# EAGLE design max32625pico (EAGLE 7.5.0)
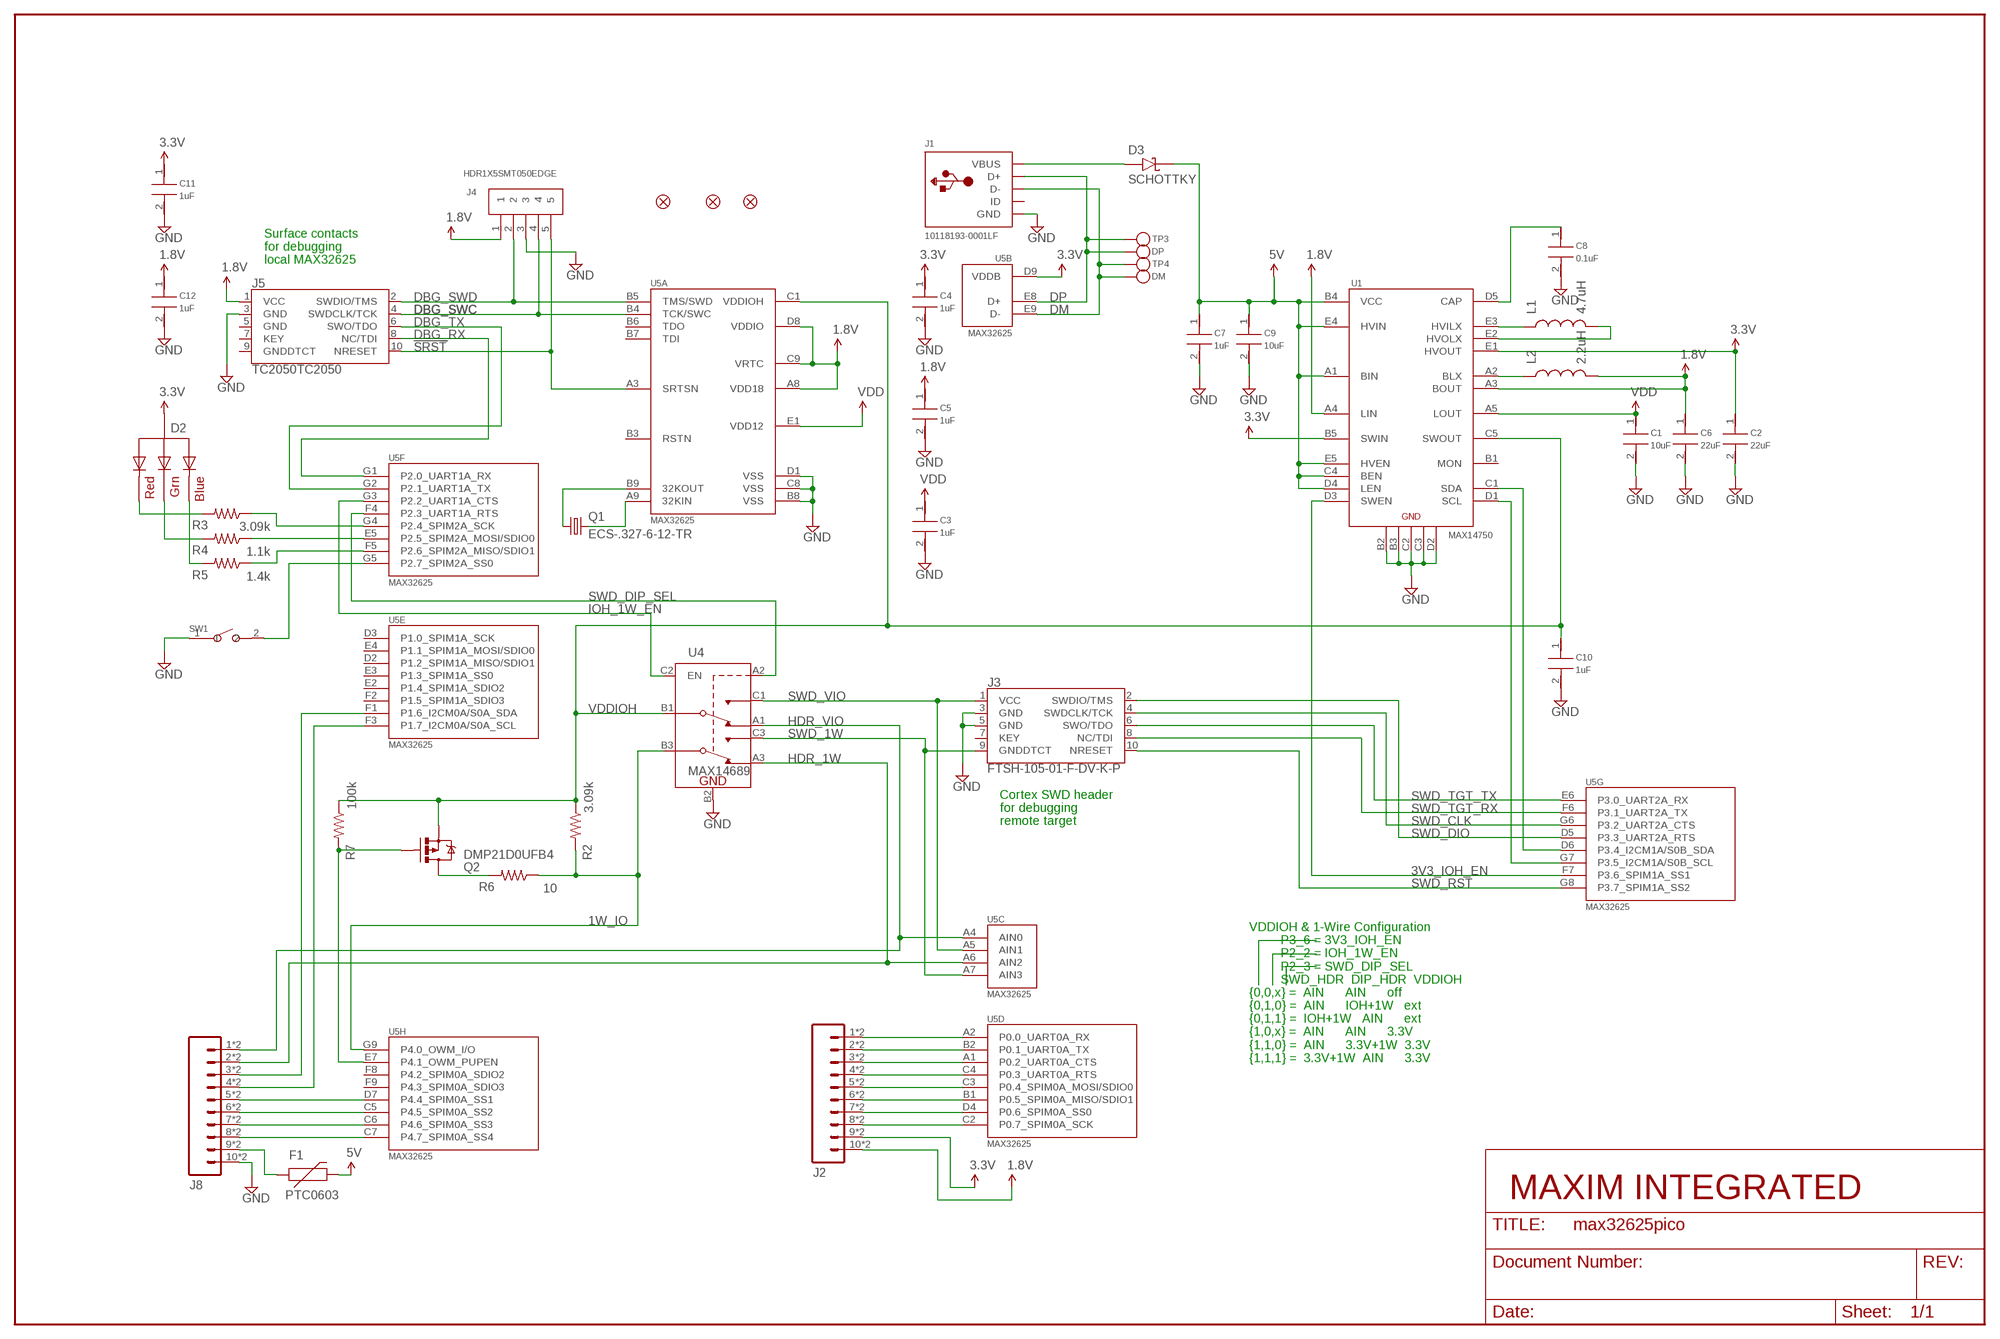
[diagram p0: schematic, sheet 1]

## Parts
C1  10uF  C  [0402]
C2  22uF  C  [0402]
C3  1uF  C  [0402]
C4  1uF  C  [0402]
C5  1uF  C  [0402]
C6  22uF  C  [0402]
C7  1uF  C  [0402]
C8  0.1uF  C  [0402]
C9  10uF  C  [0402]
C10  1uF  C  [0402]
C11  1uF  C  [0402]
C12  1uF  C  [0402]
D2  RGBLED_CALUMIX-SML-LX0404  [LUMIX-SML-LX0404]
D3  SCHOTTKY  [DCSP1006010-N1]
DM  TESTPOINTROUND1.5MM  [TESTPOINT_ROUND_1.5MM]
DP  TESTPOINTROUND1.5MM  [TESTPOINT_ROUND_1.5MM]
F1  PTC0603  [0603]
FD1  FIDUCIALUFIDUCIAL  [MICRO-FIDUCIAL]
FD2  FIDUCIALUFIDUCIAL  [MICRO-FIDUCIAL]
FD5  FIDUCIALUFIDUCIAL  [MICRO-FIDUCIAL]
J1  10118193-0001LF  MICRO-USB-SMD-B-(10118193-0001LF)  [MICRO-USB5+6P-SMD-0.65-B]
J2  M10SMT_L  [1X10_SMT_L]
J3  FTSH-105-01-F-DV-K-P  CORTEX_DEBUGSMD  [SAMTECH_FTSH-105-01]
J4  HDR1X5SMT050EDGE  [HDR_SMT_1X5_050_EDGE]
J5  TC2050TC2050  [TC2050]
J8  M10SMT_R  [1X10_SMT_R]
L1  4.7uH  INDUCTOR2016  [IND2016]
L2  2.2uH  INDUCTOR2016  [IND2016]
Q1  ECS-.327-6-12-TR  FC-12M  [FC-12M]
Q2  DMP21D0UFB4  PMZ600UNE  [SOT-883]
R2  3.09k  R-US_0402  [0402]
R3  3.09k  R-US_0402  [0402]
R4  1.1k  R-US_0402  [0402]
R5  1.4k  R-US_0402  [0402]
R6  10  R-US_0402  [0402]
R7  100k  R-US_0402  [0402]
SW1  SMD-BUTTON(2P-3.0X2.5X1.2+0.4MM)-B3U-1000P-2P-SMD  [SW2-2.6-3.0X2.5X1.2+0.4MM]
TP3  TESTPOINTRECT25X50MIL  [TESTPOINT_RECT_25X50MIL]
TP4  TESTPOINTRECT25X50MIL  [TESTPOINT_RECT_25X50MIL]
U1  MAX14750  [W252M2-1]
U4  MAX14689  [W91J1-1]
U5  MAX32625  [W633B3-1]
U$1  MAXIM_LOGO  [MXM_LOGO_6MM]

## Nets
1.8V: C5.1 C6.1 C12.1 J2.10 J2.S10 J4.1 J5.1(VCC) L2.2 U1.A3(BOUT) U1.A4(LIN) U5.A8(A:VDD18) U5.C9(A:VRTC) U5.D8(A:VDDIO)
1W_IO: R2.2 R6.1 U4.B3(COM2) U5.G9(H:P4.0_OWM_I/O)
3.3V: C2.1 C4.1 C11.1 D2.1(VCC) J2.9 J2.S9 U1.B5(SWIN) U1.E1(HVOUT) U5.D9(B:VDDB)
3V3_IOH_EN: U1.D3(SWEN) U5.F7(G:P3.6_SPIM1A_SS1)
5V: C7.1 C9.1 D3.1(C) F1.2 U1.A1(BIN) U1.B4(VCC) U1.C4(BEN) U1.D4(LEN) U1.E4(HVIN) U1.E5(HVEN)
!SRST: J4.5 J5.10(NRESET) U5.A3(A:SRTSN)
DBG_RX: J5.8(NC/TDI) U5.G1(F:P2.0_UART1A_RX)
DBG_SWC: J4.4 J5.4(SWDCLK/TCK) U5.B4(A:TCK/SWC)
DBG_SWD: J4.2 J5.2(SWDIO/TMS) U5.B5(A:TMS/SWD)
DBG_TX: J5.6(SWO/TDO) U5.G2(F:P2.1_UART1A_TX)
DM: DM.P$1 J1.2(D-) TP4.P$1 U5.E9(B:D-)
DP: DP.P$1 J1.3(D+) TP3.P$1 U5.E8(B:D+)
GND: C1.2 C2.2 C3.2 C4.2 C5.2 C6.2 C7.2 C8.2 C9.2 C10.2 C11.2 C12.2 J1.5(GND) J1.S1(GND) J1.S2(GND) J1.S3(GND) J1.S4(GND) J1.S5(GND) J1.S6(GND) J3.3(GND) J3.5(GND) J4.3 J5.3(GND) J8.10 J8.S10 SW1.1 U1.B2(GND) U1.B3(GND) U1.C2(GND) U1.C3(GND) U1.D2(GND) U4.B2(GND) U5.B8(A:VSS) U5.C8(A:VSS) U5.D1(A:VSS)
HDR_1W: J8.2 J8.S2 U4.A3(NC2) U5.A6(C:AIN2)
HDR_VIO: J8.1 J8.S1 U4.A1(NC1) U5.A4(C:AIN0)
IOH_1W_EN: U4.C2(EN) U5.G3(F:P2.2_UART1A_CTS)
N$1: J2.1 J2.S1 U5.A2(D:P0.0_UART0A_RX)
N$2: J2.2 J2.S2 U5.B2(D:P0.1_UART0A_TX)
N$4: C8.1 U1.D5(CAP)
N$5: J2.3 J2.S3 U5.A1(D:P0.2_UART0A_CTS)
N$6: J2.4 J2.S4 U5.C4(D:P0.3_UART0A_RTS)
N$7: R4.1 U5.E5(F:P2.5_SPIM2A_MOSI/SDIO0)
N$8: R3.1 U5.G4(F:P2.4_SPIM2A_SCK)
N$9: R5.1 U5.F5(F:P2.6_SPIM2A_MISO/SDIO1)
N$10: D2.2(RED) R3.2
N$11: D2.4(GREEN) R4.2
N$12: D2.3(BLUE) R5.2
N$13: D3.2(A) J1.1(VBUS)
N$14: Q1.2 U5.A9(A:32KIN)
N$15: Q1.1 U5.B9(A:32KOUT)
N$16: J2.5 J2.S5 U5.C3(D:P0.4_SPIM0A_MOSI/SDIO0)
N$17: J2.6 J2.S6 U5.B1(D:P0.5_SPIM0A_MISO/SDIO1)
N$18: J2.7 J2.S7 U5.D4(D:P0.6_SPIM0A_SS0)
N$19: J2.8 J2.S8 U5.C2(D:P0.7_SPIM0A_SCK)
N$21: F1.1 J8.9 J8.S9
N$22: Q2.3(D) R6.2
N$23: J8.8 J8.S8 U5.C7(H:P4.7_SPIM0A_SS4)
N$24: J8.7 J8.S7 U5.C6(H:P4.6_SPIM0A_SS3)
N$25: J8.6 J8.S6 U5.C5(H:P4.5_SPIM0A_SS2)
N$26: J8.5 J8.S5 U5.D7(H:P4.4_SPIM0A_SS1)
N$27: J8.4 J8.S4 U5.F3(E:P1.7_I2CM0A/S0A_SCL)
N$28: J8.3 J8.S3 U5.F1(E:P1.6_I2CM0A/S0A_SDA)
N$29: SW1.2 U5.G5(F:P2.7_SPIM2A_SS0)
N$30: L1.1 U1.E3(HVILX)
N$31: L2.1 U1.A2(BLX)
N$32: U1.D1(SCL) U5.G7(G:P3.5_I2CM1A/S0B_SCL)
N$33: L1.2 U1.E2(HVOLX)
N$34: U1.C1(SDA) U5.D6(G:P3.4_I2CM1A/S0B_SDA)
N$35: Q2.1(G) R7.2 U5.E7(H:P4.1_OWM_PUPEN)
SWD_1W: J3.9(GNDDTCT) U4.C3(NO2) U5.A7(C:AIN3)
SWD_CLK: J3.4(SWDCLK/TCK) U5.G6(G:P3.2_UART2A_CTS)
SWD_DIO: J3.2(SWDIO/TMS) U5.D5(G:P3.3_UART2A_RTS)
SWD_DIP_SEL: U4.A2(CB) U5.F4(F:P2.3_UART1A_RTS)
SWD_RST: J3.10(NRESET) U5.G8(G:P3.7_SPIM1A_SS2)
SWD_TGT_RX: J3.8(NC/TDI) U5.F6(G:P3.1_UART2A_TX)
SWD_TGT_TX: J3.6(SWO/TDO) U5.E6(G:P3.0_UART2A_RX)
SWD_VIO: J3.1(VCC) U4.C1(NO1) U5.A5(C:AIN1)
VDD: C1.1 C3.1 U1.A5(LOUT) U5.E1(A:VDD12)
VDDIOH: C10.1 Q2.2(S) R2.1 R7.1 U1.C5(SWOUT) U4.B1(COM1) U5.C1(A:VDDIOH)
Unconnected: J1.4(ID) J3.7(KEY) J5.5(GND) J5.7(KEY) J5.9(GNDDTCT) U1.B1(MON) U5.B3(A:RSTN) U5.B6(A:TDO) U5.B7(A:TDI) U5.D2(E:P1.2_SPIM1A_MISO/SDIO1) U5.D3(E:P1.0_SPIM1A_SCK) U5.E2(E:P1.4_SPIM1A_SDIO2) U5.E3(E:P1.3_SPIM1A_SS0) U5.E4(E:P1.1_SPIM1A_MOSI/SDIO0) U5.F2(E:P1.5_SPIM1A_SDIO3) U5.F8(H:P4.2_SPIM0A_SDIO2) U5.F9(H:P4.3_SPIM0A_SDIO3)

## Notes on the sheet
- Surface contacts 
  for debugging 
  local MAX32625
- Cortex SWD header
  for debugging 
  remote target
- VDDIOH & 1-Wire Configuration
           P3_6 = 3V3_IOH_EN
           P2_2 = IOH_1W_EN
           P2_3 = SWD_DIP_SEL
           SWD_HDR  DIP_HDR  VDDIOH
  {0,0,x} =  AIN      AIN      off
  {0,1,0} =  AIN      IOH+1W   ext
  {0,1,1} =  IOH+1W   AIN      ext
  {1,0,x} =  AIN      AIN      3.3V
  {1,1,0} =  AIN      3.3V+1W  3.3V
  {1,1,1} =  3.3V+1W  AIN      3.3V

## Library data of the parts
C1-C12 = maxlib:C: C Capacitor
D2 = maxlib:RGBLED_CA: RGB LED, common-anode Lumix SML-LX0404 1mm x 1mm 5MM Staggered pins 5mm Piranha package http://www.ladyada.net/library/pcb/eaglelibrary.html
D3 = maxlib:SCHOTTKY: Schottky Diode
DM DP TP3 TP4 = maxlib:TESTPOINT: Test Point Various test points for characterisation and PCB testing TESTPOINT_SMT - Compact Surface Mount Test Point [Digikey: 5016KTR-ND]
F1 = maxlib:PTC: Resettable Fuse PTC Resettable Fuse. Spark Fun Electronics SKU : COM-08357
FD1 FD2 FD5 = SparkFun-Aesthetics:FIDUCIAL: Fiducial Alignment Points Various fiducial points for machine vision alignment.
J1 = maxlib:MICRO-USB-SMD-B-(10118193-0001LF): 320010003; MPN: 10118193-0001LF
J2 J8 = maxlib:M10: Header 10 Standard 10-pin 0.1" header. Use with straight break away headers (SKU : PRT-00116), right angle break away headers (PRT-00553), swiss pins (PRT-00743), machine pins (PRT-00117), and female headers (PRT-00115).
J3 = maxlib:CORTEX_DEBUG: Cortex Debug Connector Datasheet <http://infocenter.arm.com/help/topic/com.arm.doc.faqs/attached/13634/cortex_debug_connectors.pdf>
J4 = maxlib:HDR1X5SMT050EDGE: 1x5 SMT Header 50mil Pitch 1x5 50mil pitch SMT header for edge mount
J5 = maxlib:TC2050: TAG-CONNECT ISP Connector Manufacturer: Tag-Connect <www.tag-connect.com> Cable for easy In-Circuit PCB Programming. Designed for JTAG 10 pin, suitable for many others. Pin Connection for TC2050 NL. PAD Description 1 VCC 2 SWD 3 GND 4 SWC 5 GND 6 TX 7 NC 8 RX 9 DETECT 10 RESET ©2009 ROFA.cz Modified 7/2011 by Tim McCarthy-Smith VIDA Products INC
L1 L2 = maxlib:INDUCTOR: Inductor Inductors
Q1 = crystal:FC-12M: kHz RANGE CRYSTAL UNIT LOW PROFILE SMD Source: Epson Toyocom FC-12M.pdf
Q2 = maxlib:PMZ600UNE
R2-R7 = maxlib:R-US_: RESISTOR, American symbol
SW1 = maxlib:SMD-BUTTON(2P-3.0X2.5X1.2+0.4MM): 311020047
U1 = maxlib:MAX14750
U4 = maxlib:MAX14689
U5 = maxlib:MAX32625: MAX32625 Ultra-Low Power, High-Performance Cortex-M4F Microcontroller for Wearables
U$1 = maxlib:MAXIM_LOGO: Maxim Logo

## Board
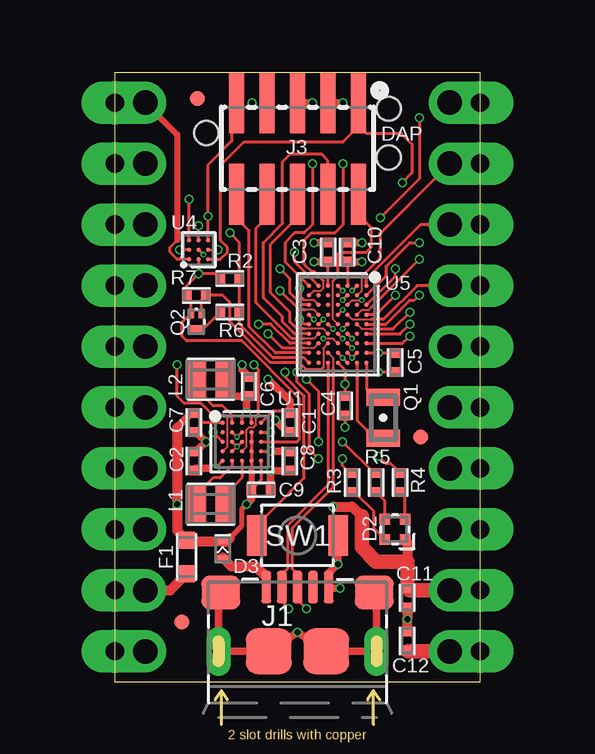
[diagram p1: board, top side]
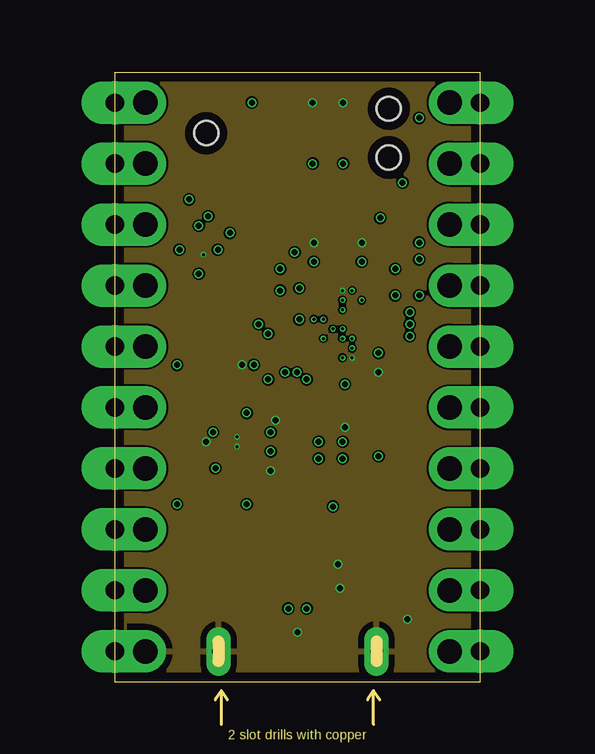
[diagram p2: board, inner layer Route2]
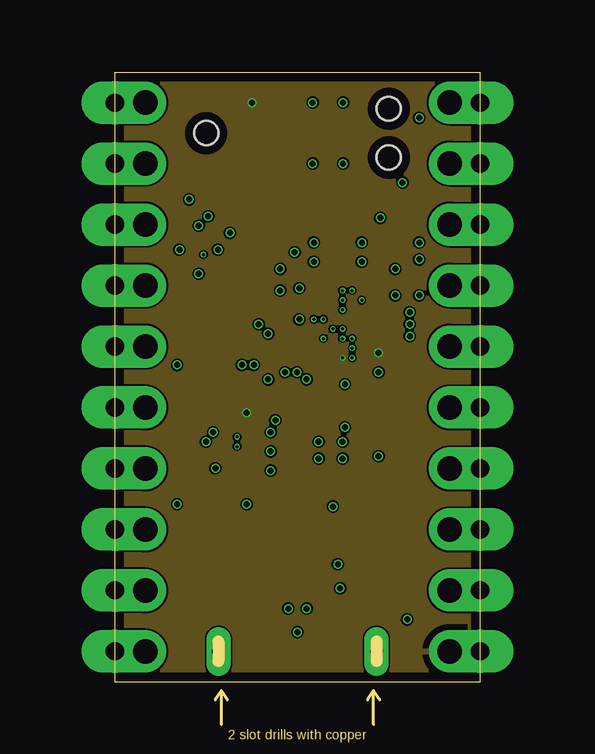
[diagram p3: board, inner layer Route15]
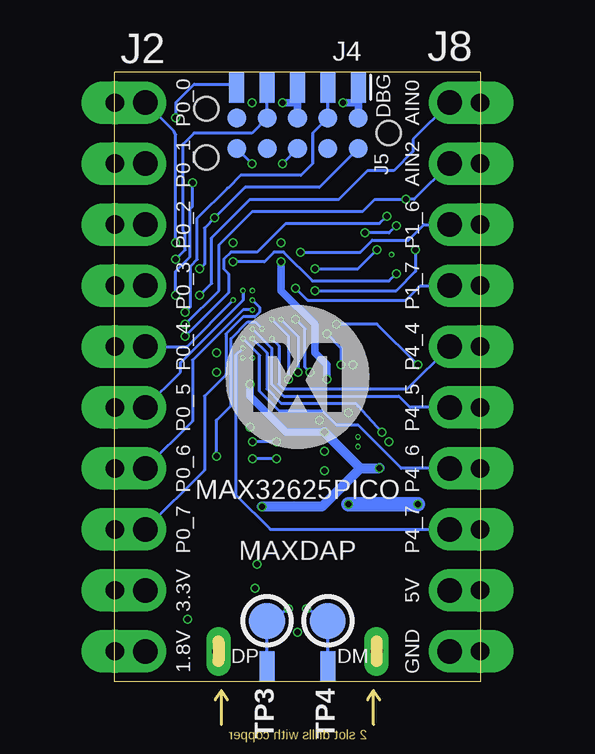
[diagram p4: board, bottom side, seen from below]

Size 15.24 x 25.4 mm. Coordinates in mm from the lower left corner, seen from the top.
Outline: 0,0 15.24,0 15.24,25.4 0,25.4 0,0
Copper layers (1+2*15+16): Top 0.035mm / dielectric 0.18mm / Route2 0.035mm / dielectric 0.15mm / Route15 0.035mm / dielectric 0.18mm / Bottom 0.035mm
Design rules "default *": minimum track width 0.075mm, minimum drill 4mil, track to track 0.07mm, track to pad 0.07mm, pad to pad 0.1mm, via to via 0.125mm, smd to smd 0.07mm, copper to edge 15mil, drill to drill 8mil, minimum pad ring 10mil, minimum via ring 2mil, stop-mask expansion 0mil, vias tented up to drill 15mil, thermal gap 10mil

### Footprints (pad centres in the part's own frame; a part is rotated, then mirrored left to right if it is on the bottom)
0402 = smd 0.5 x 0.4: 1 0,0.4; 2 0,-0.4
LUMIX-SML-LX0404 = smd 0.45 x 0.45: 1 -0.425,0.425; 2 0.425,0.425; 3 0.425,-0.425; 4 -0.425,-0.425
DCSP1006010-N1 = smd 0.47 x 0.21: 1 0,0.33; 2 0,-0.33
TESTPOINT_ROUND_1.5MM = smd 1.5 x 1.5: P$1 0,0
0603 = smd 0.7 x 0.7: 1 0,0.7; 2 0,-0.7
MICRO-FIDUCIAL = smd 0.635 x 0.635: 1 0,0
MICRO-USB5+6P-SMD-0.65-B = smd 0.4 x 1.35: 1 -1.3,2.675; 2 -0.65,2.675; 3 0,2.675; 4 0.65,2.675; 5 1.3,2.675 | smd 1.6 x 1.4: S1 -3.2,2.45; S6 3.2,2.45 | drill 0.508 pad 1.016 long: S2 -3.3,0; S5 3.3,0 | smd 1.9 x 1.9: S3 -1.2,0; S4 1.2,0
1X10_SMT_L = drill 1.016 pad 1.778 offset: 1 0,0; 2 2.54,0; 3 5.08,0; 4 7.62,0; 5 10.16,0; 6 12.7,0; 7 15.24,0; 8 17.78,0; 9 20.32,0; 10 22.86,0 | drill 0.762 pad 1.778: S1 0,-1.27; S2 2.54,-1.27; S3 5.08,-1.27; S4 7.62,-1.27; S5 10.16,-1.27; S6 12.7,-1.27; S7 15.24,-1.27; S8 17.78,-1.27; S9 20.32,-1.27; S10 22.86,-1.27
SAMTECH_FTSH-105-01 = smd 0.635 x 2.54: 1 -2.54,-1.905; 2 -2.54,1.905; 3 -1.27,-1.905; 4 -1.27,1.905; 5 0,-1.905; 6 0,1.905; 7 1.27,-1.905; 8 1.27,1.905; 9 2.54,-1.905; 10 2.54,1.905
HDR_SMT_1X5_050_EDGE = smd 0.635 x 1.27: 1 -2.54,0; 2 -1.27,0; 3 0,0; 4 1.27,0; 5 2.54,0
TC2050 = smd 0.787 x 0.787: 1 1.27,-0.635; 2 2.54,-0.635; 3 3.81,-0.635; 4 5.08,-0.635; 5 6.35,-0.635; 6 6.35,0.635; 7 5.08,0.635; 8 3.81,0.635; 9 2.54,0.635; 10 1.27,0.635 | hole 1: 0,0; 7.62,-1.016; 7.62,1.016
1X10_SMT_R = drill 1.016 pad 1.778 offset: 1 0,0; 2 2.54,0; 3 5.08,0; 4 7.62,0; 5 10.16,0; 6 12.7,0; 7 15.24,0; 8 17.78,0; 9 20.32,0; 10 22.86,0 | drill 0.762 pad 1.778: S1 0,1.27; S2 2.54,1.27; S3 5.08,1.27; S4 7.62,1.27; S5 10.16,1.27; S6 12.7,1.27; S7 15.24,1.27; S8 17.78,1.27; S9 20.32,1.27; S10 22.86,1.27
IND2016 = smd 1.6 x 0.8: 1 0,0.6; 2 0,-0.6
FC-12M = smd 0.7 x 1.4: 1 -0.85,0; 2 0.85,0
SOT-883 = smd 0.25 x 0.4: 1 -0.225,-0.35; 2 0.225,-0.35 | smd 0.7 x 0.4: 3 0,0.35
SW2-2.6-3.0X2.5X1.2+0.4MM = smd 0.8 x 1.7: 1 -1.7,0; 2 1.7,0
TESTPOINT_RECT_25X50MIL = smd 1.27 x 0.635: P$1 0,0
W252M2-1 = smd 0.18 x 0.18: A1 -0.8,0.8; A2 -0.4,0.8; A3 0,0.8; A4 0.4,0.8; A5 0.8,0.8; B1 -0.8,0.4; B2 -0.4,0.4; B3 0,0.4; B4 0.4,0.4; B5 0.8,0.4; C1 -0.8,0; C2 -0.4,0; C3 0,0; C4 0.4,0; C5 0.8,0; D1 -0.8,-0.4; D2 -0.4,-0.4; D3 0,-0.4; D4 0.4,-0.4; D5 0.8,-0.4; E1 -0.8,-0.8; E2 -0.4,-0.8; E3 0,-0.8; E4 0.4,-0.8; E5 0.8,-0.8
W91J1-1 = smd 0.18 x 0.18: A1 -0.4,0.4; A2 0,0.4; A3 0.4,0.4; B1 -0.4,0; B2 0,0; B3 0.4,0; C1 -0.4,-0.4; C2 0,-0.4; C3 0.4,-0.4
W633B3-1 = smd 0.18 x 0.18: A1 -1.6,1.2; A2 -1.2,1.2; A3 -0.8,1.2; A4 -0.4,1.2; A5 0,1.2; A6 0.4,1.2; A7 0.8,1.2; A8 1.2,1.2; A9 1.6,1.2; B1 -1.6,0.8; B2 -1.2,0.8; B3 -0.8,0.8; B4 -0.4,0.8; B5 0,0.8; B6 0.4,0.8; B7 0.8,0.8; B8 1.2,0.8; B9 1.6,0.8; C1 -1.6,0.4; C2 -1.2,0.4; C3 -0.8,0.4; C4 -0.4,0.4; C5 0,0.4; C6 0.4,0.4; C7 0.8,0.4; C8 1.2,0.4; C9 1.6,0.4; D1 -1.6,0; D2 -1.2,0; D3 -0.8,0; D4 -0.4,0; D5 0,0; D6 0.4,0; D7 0.8,0; D8 1.2,0; D9 1.6,0; E1 -1.6,-0.4; E2 -1.2,-0.4; E3 -0.8,-0.4; E4 -0.4,-0.4; E5 0,-0.4; E6 0.4,-0.4; E7 0.8,-0.4; E8 1.2,-0.4; E9 1.6,-0.4; F1 -1.6,-0.8; F2 -1.2,-0.8; F3 -0.8,-0.8; F4 -0.4,-0.8; F5 0,-0.8; F6 0.4,-0.8; F7 0.8,-0.8; F8 1.2,-0.8; F9 1.6,-0.8; G1 -1.6,-1.2; G2 -1.2,-1.2; G3 -0.8,-1.2; G4 -0.4,-1.2; G5 0,-1.2; G6 0.4,-1.2; G7 0.8,-1.2; G8 1.2,-1.2; G9 1.6,-1.2

### Placement (x,y rotation side)
C1  7.3,10.8 0 top
C2  3.3,9.2 180 top
C3  8.9,17.9 180 top
C4  9.6,11.5 0 top
C5  11.7,13.3 0 top
C6  5.6,12.3 180 top
C7  3.3,10.8 0 top
C8  7.3,9.2 0 top
C9  6.1,8 90 top
C10  9.7,17.9 180 top
C11  12.2,3.5 0 top
C12  12.2,1.7 180 top
D2  11.68,6.35 180 top
D3  4.5,5.5 0 top
DM  6.35,2.54 0 bottom
DP  8.89,2.54 0 bottom
DRILEGEND  [DRILEGEND]  1.08,-6.65 0 top  (outside the outline)
F1  3,5.2 180 top
FD1  12.76,10.2 90 top
FD2  3.44,24.3 0 top
FD5  2.8,2.5 270 top
J1  7.62,1.27 0 top
J2  13.97,24.13 270 bottom
J3  7.62,22.23 180 top
J4  7.62,24.77 180 bottom
J5  3.81,22.86 180 bottom
J8  1.27,24.13 270 bottom
L1  4,7.4 270 top
L2  4,12.6 90 top
Q1  11.2,11 90 top
Q2  3.4,15 180 top
R2  4.8,16.8 90 top
R3  9.9,8.3 0 top
R4  11.9,8.3 0 top
R5  10.9,8.3 0 top
R6  4.8,15.4 270 top
R7  3.4,16.1 90 top
SW1  7.62,6.1 180 top
TP3  8.89,0.64 270 bottom
TP4  6.35,0.64 270 bottom
U1  5.3,10 0 top
U4  3.5,18 90 top
U5  9.3,14.9 270 top
U$1  7.62,12.7 0 bottom

### Tracks (layer width: path | path; a pad name or v marks a point on that pad's centre or on a via)
1.8V  (via drill 0.12, 0.25)
  Top 0.125: U5.A8 v11,13.7 C5.1 | U5.D8 v9.5,13.5 U5.C9 | U1.A3 5.3,11 v5.5,11.2 5.7,11 U1.A4
  Top 0.305: v5.5,11.2 5.5,11.8 C6.1 4.9,11.9 4.8,12 4.8,12.4 L2.2
  Top 0.406: 12.23,1.27 C12.1
  Top 0.61: J2.10 12.23,1.27
  Bottom 0.305: J4.1 5.08,24.13 | 5.08,24.13 J5.1 | v5.71,24.13 5.08,24.13
  pour Route15: 0,0 0,25.4 15.24,25.4 15.24,0
1W_IO  (via drill 0.25)
  Top 0.125: U4.B3 v3.5,19 | v4.8,18.7 5.2,18.3 R2.2 R6.1 5.2,14.9 6.6,13.5 7.9,13.5 U5.G9
  Bottom 0.125: v3.5,19 3.8,18.7 v4.8,18.7
3.3V  (via drill 0.25)
  Top 0.125: U1.E1 v4.2,8.9 | 3.4,8.9 C2.1 | U5.D9 9.6,13 v9.6,12.4 C4.1 | U1.B5 v6.5,10.4
  Top 0.305: v4.2,8.9 3.4,8.9 | J2.9 J2.S9
  Top 0.406: 12.29,3.81 C11.1 | v9.1,7.3 9.9,7.3 10.3,6.9 | D2.1 12.2,5.83 12.2,5
  Top 0.61: J2.9 12.29,3.81 | 10.3,6.9 10.3,5.6 10.9,5 12.2,5 C11.1
  Bottom 0.305: v9.6,12.4 C4.1 8.1,10.4 v6.5,10.4
  Bottom 0.406: 5,8.9 v4.2,8.9 | v6.5,10.4 5,8.9 | 5,8.9 6.6,7.3 v9.1,7.3
3V3_IOH_EN  (via drill 0.25)
  Top 0.075: U1.D3 5.5,9.8 5.5,10.5 5.6,10.6 5.8,10.6 5.9,10.7 5.9,11 | U5.F7 8.3,13.9 7.9,13.9
  Top 0.125: 7.9,13.9 7,13.9 v6.4,14.5 | 5.9,11 6,11.1 6,13 v5.8,13.2
  Bottom 0.125: v6.4,14.5 5.8,13.9 v5.8,13.2
5V  (via drill 0.25)
  Top 0.125: 3.4,11.1 C7.1 | 5.7,8.8 U1.E4 U1.D4 U1.C4 U1.B4 | 3.1,11.1 3.2,11.2 C7.1 | U1.A1 3.7,10.8 C7.1 | U1.E5 6.1,8.4 C9.1
  Top 0.203: 4.8,6 5.3,6.5 5.3,7.2 v5.5,7.4
  Top 0.254: 5.7,8.8 C9.1
  Top 0.305: 2.6,10.6 3.1,11.1 | C9.1 5.7,7.6 v5.5,7.4
  Top 0.406: 2.6,10.6 v2.6,7.4 2.6,6.3 F1.2 3.07,5.83 D3.1 4.63,5.83 4.8,6
  Bottom 0.61: v5.5,7.4 v2.6,7.4
!SRST  (via drill 0.25)
  Top 0.125: U5.A3 11.7,16.9 v11.7,17.2
  Top 0.127: v12.7,23.5 12.7,20.95 v11.07,19.33
  Bottom 0.125: v11.7,17.2 11.5,17.4 11.5,18.9 v11.07,19.33 9.8,20.6 6.71,20.6 J5.10
  Bottom 0.127: v12.7,23.5 12.7,24.13 11.93,24.9 10.29,24.9 J4.5
DBG_RX  (via drill 0.25)
  Top 0.125: v8.26,21.59 8.26,19.05 8.25,19.05 7.9,18.7 7.5,18.7 7.1,18.3 7.1,17.5 U5.G1
  Bottom 0.125: J5.8 v8.26,21.59
DBG_SWC  (via drill 0.25)
  Top 0.075: U5.B4 10.3,15.5 10.6,15.5 10.7,15.6
  Top 0.125: 10.7,15.6 v12.7,17.6
  Bottom 0.125: v12.7,17.6 12.3,18 12.3,18.7 12.4,18.8 12.4,22.4 11.94,22.86 9.53,22.86 J5.4 J4.4
DBG_SWD  (via drill 0.25)
  Top 0.075: U5.B5 10.3,14.7 10.7,14.7
  Top 0.125: 10.7,14.7 11.6,14.7 v12.3,15.4
  Bottom 0.125: v12.3,15.4 12.1,15.6 12.1,17.3 11.8,17.6 11.8,19.32 10.54,20.57 10.53,20.57 10,21.1 7.47,21.1 6.99,21.59 6.99,22.86 J5.2 J4.2
DBG_TX  (via drill 0.25)
  Top 0.075: U5.G2 8.3,16.3 8.6,16.3 8.7,16.4 8.7,16.7
  Top 0.125: v9.53,21.59 9.53,19.05 9.18,18.7 8.2,18.7 7.9,18.4 7.9,17.4 8.2,17.1 8.3,17.1 8.7,16.7
  Bottom 0.125: J5.6 v9.53,21.59
DM  (via drill 0.25)
  Top 0.125: U5.E9 8.9,8.2 7.2,6.5 7.2,4.7
  Top 0.127: 7.2,4.7 6.97,4.47 J1.2 7.1,3.81 7.1,3.19 v7.24,3.05
  Bottom 0.127: v7.24,3.05 DM.P$1 TP4.P$1
DP  (via drill 0.25)
  Top 0.075: U5.E8 9.1,13.5 9.1,13.1
  Top 0.125: 9.1,13.1 9.1,8.1 7.4,6.4 7.4,4.7
  Top 0.127: 7.62,3.68 J1.3 | J1.3 7.62,4.48 7.4,4.7 | v8,3.05 7.62,3.43 J1.3
  Bottom 0.127: v8,3.05 DP.P$1 TP3.P$1
GND  (via drill 0.12, 0.25)
  Top 0.125: C2.2 3.5,9.7 | C7.2 3.5,10.3 | U1.B2 v5.1,10.2 U1.B3 | U1.C2 v5.1,9.8 | U1.D2 v5.1,9.8 | v5.1,9.8 U1.C3 | C4.2 v9.6,10.6 | C5.2 v11,12.9 | U5.C8 v9.9,13.5 U5.B8 | U5.D1 v9.5,16.3 | 8.89,23.5 J3.3 | U4.B2 v3.7,17.8
  Top 0.305: 3.5,9.7 v3.8,10 3.5,10.3 | C9.2 v6.5,8.8 C8.2 | C10.2 v10.3,18.3 | C3.2 v8.3,18.3 | C6.2 5.3,13 v5.3,13.2 | C1.2 7.2,10.4 v6.7,10.9 | 8.89,23.19 8.89,23.5 | J5.3 J3.5 v8.26,24.13 | v9.53,24.13 J3.3 | J1.S6 10.92,3.8 J1.S5 J1.S4 v7.62,2.07 J1.S3 J1.S2 4.32,3.8 J1.S1 | v9.4,3.9 8.96,3.9 J1.5 8.92,4.52 v9.3,4.9 9.3,6.08 SW1.1
  Top 0.406: C12.2 v12.2,2.6 C11.2
  Bottom 0.305: J4.3 J3.5 | J3.5 J5.3 | v8.26,24.13 J3.5
  pour Route2: 0,0 0,25.4 15.24,25.4 15.24,0
HDR_1W  (via drill 0.25)
  Top 0.125: U5.A6 11.9,14.5 v12.3,14.9 | U4.A3 v3.1,20.1
  Top 0.305: J8.2 J8.S2
  Bottom 0.125: v12.3,14.9 10.9,16.3 10.9,18.2 9.5,19.6 4.9,19.6 4.4,20.1 v3.1,20.1 2.76,20.1 J8.2
HDR_VIO  (via drill 0.25)
  Top 0.125: v11.7,16.1 10.9,15.3 U5.A4 | U4.A1 2.6,17.6 2.3,17.9 2.3,18.1 2.6,18.4
  Top 0.25: J8.1 2.6,22.8 2.6,18.4
  Top 0.305: J8.1 J8.S1
  Bottom 0.125: v11.7,16.1 11.2,16.6 11.2,18.5 9.6,20.1 5.9,20.1 4.7,21.3 3.6,21.3 2.8,22.1 2.8,22.6 J8.1
IOH_1W_EN  (via drill 0.25)
  Top 0.125: U4.C2 v4.3,18 | U5.G3 7.8,15.7 7.3,16.2 7.3,16.8 v6.9,17.2
  Bottom 0.125: v6.9,17.2 5.1,17.2 v4.3,18
N$1  (via drill 0.25)
  Top 0.125: v12.7,18.3 12.3,18.3 11.3,17.3 11.3,16.9 U5.A2
  Top 0.305: J2.1 J2.S1
  Bottom 0.125: J2.1 12.77,22.93 12.7,22.8 v12.7,18.3
N$2
  Top 0.075: U5.B2 10.3,16.3 10.3,16.9
  Top 0.125: 10.3,16.9 11.05,17.65 11.05,18.67 J2.2
  Top 0.305: J2.2 J2.S2
N$4  (via drill 0.25)
  Top 0.125: U1.D5 v6.5,9.6
  Top 0.305: v6.5,9.6 C8.1
N$5
  Top 0.125: J2.3 12.75,19.05 10.5,16.8 U5.A1
  Top 0.305: J2.3 J2.S3
N$6
  Top 0.075: U5.C4 9.9,15.1 10.7,15.1
  Top 0.125: 10.7,15.1 11.2,15.1 12.61,16.51 J2.4
  Top 0.305: J2.4 J2.S4
N$7  (via drill 0.12, 0.25)
  Top 0.125: U5.E5 v9.1,14.7 | 11.8,8.7 R4.1 11.5,9.1 11.3,9.1 v11,9.4
  Bottom 0.125: v11,9.4 11,10.9 10.4,11.5 10.4,14.3 9.7,15 9.4,15 v9.1,14.7
N$8  (via drill 0.12, 0.25)
  Top 0.125: v8.5,9.3 8.1,9.7 8.1,12 7.6,12.5 v7.6,12.9 | R3.1 9.8,8.7 9.5,9 v9.5,9.3 | U5.G4 v8.3,15.1
  Bottom 0.125: v8.5,9.3 v9.5,9.3 | v8.3,15.1 7.6,14.4 v7.6,12.9
N$9  (via drill 0.12, 0.25)
  Top 0.125: U5.F5 v8.7,15.1 | v8.5,10 8.5,12.1 v8,12.6 | v9.5,10 10.8,8.7 R5.1
  Bottom 0.125: v8.7,15.1 8,14.4 v8,12.6 | v8.5,10 v9.5,10
N$10
  Top 0.127: D2.2 11.26,5.94 10.8,6.4 10.8,7.1 10,7.9 R3.2
N$11
  Top 0.127: D2.4 12.11,7.69 R4.2
N$12
  Top 0.127: D2.3 11.26,7.54 R5.2
N$13
  Top 0.305: J1.1 6.32,4.38
  Top 0.406: 6.32,4.38 5.9,4.8 4.87,4.8 D3.2
N$14
  Top 0.125: U5.A9 10.5,12.2 10.6,12.1 10.95,12.1 Q1.2
N$15
  Top 0.125: U5.B9 10.1,10.9 10.6,10.4 10.95,10.4 Q1.1
N$16  (via drill 0.12)
  Top 0.075: U5.C3 9.9,15.9 v10.3,15.9
  Top 0.305: J2.5 J2.S5
  Bottom 0.125: J2.5 12.23,13.97 v10.3,15.9
N$17  (via drill 0.12)
  Top 0.125: U5.B1 v9.9,16.3
  Top 0.305: J2.6 J2.S6
  Bottom 0.125: J2.6 12.5,12.9 12.5,13.3 9.9,15.9 v9.9,16.3
N$18  (via drill 0.12)
  Top 0.125: U5.D4 v9.5,15.5
  Top 0.305: J2.7 J2.S7
  Bottom 0.125: v9.5,15.5 9.9,15.5 12,13.4 12,10.86 J2.7
N$19  (via drill 0.12)
  Top 0.125: U5.C2 v9.5,15.9
  Top 0.305: J2.8 J2.S8
  Bottom 0.125: v9.5,15.9 9.2,15.6 9.2,15.4 9.4,15.2 9.9,15.2 10.6,14.5 10.6,12.8 11.5,11.9 11.5,8.82 J2.8
N$21
  Top 0.305: J8.9 J8.S9
  Top 0.406: J8.9 2.31,3.81 F1.1
N$22
  Top 0.125: Q2.3 3.65,14.65 R6.2
N$23  (via drill 0.12)
  Top 0.125: U5.C7 v9.9,13.9
  Top 0.305: J8.8 J8.S8
  Bottom 0.125: v9.9,13.9 10.2,13.6 10.2,7.8 | 8.6,6.35 8.1,6.35 J8.8
  Bottom 0.127: 10.2,7.8 8.75,6.35 8.1,6.35
N$24  (via drill 0.12)
  Top 0.125: U5.C6 v9.9,14.3
  Top 0.305: J8.7 J8.S7
  Bottom 0.125: J8.7 3.29,8.89 5.1,10.7 6,10.7 6.6,11.3 8.4,11.3 9.2,12.1 9.2,13.6 v9.9,14.3
N$25  (via drill 0.12)
  Top 0.125: U5.C5 v9.5,14.7
  Top 0.305: J8.6 J8.S6
  Bottom 0.125: v9.5,14.7 8.7,13.9 8.7,12.4 8.2,11.9 3.4,11.9 2.93,11.43 J8.6
N$26  (via drill 0.12)
  Top 0.075: U5.D7 9.1,14.3 v8.7,14.3
  Top 0.305: J8.5 J8.S5
  Bottom 0.125: v8.7,14.3 8.4,14 8.4,12.4 8.2,12.2 3.04,12.2 J8.5
N$27  (via drill 0.25)
  Top 0.075: U5.F3 8.3,15.9 7.9,15.9
  Top 0.125: 7.9,15.9 7.7,16.1 v7.7,16.4
  Top 0.305: J8.4 J8.S4
  Bottom 0.125: v7.7,16.4 7.2,15.9 3.1,15.9 2.5,16.5 J8.4
N$28  (via drill 0.25)
  Top 0.125: v7.5,17.9 7.5,17.5 U5.F1
  Top 0.305: J8.3 J8.S3
  Bottom 0.125: v7.5,17.9 5,17.9 4.5,18.4 3,18.4 2.35,19.05 J8.3
N$29  (via drill 0.25)
  Top 0.125: 6.7,7.3 7.9,8.5 7.9,11.9 7.1,12.7 v7.1,12.9 | U5.G5 7.9,14.9 v7.7,15.1
  Top 0.127: SW1.2 5.92,6.52 6.7,7.3
  Bottom 0.125: v7.1,12.9 7.3,13.1 7.3,14.7 v7.7,15.1
N$30
  Top 0.125: U1.E3 5.3,8.5 4.8,8 4.8,7.6 L1.1
N$31
  Top 0.125: U1.A2 4.9,11.1 4.5,11.5 4.1,11.5 3.6,12 3.6,12.4 L2.1
N$32  (via drill 0.25)
  Top 0.075: U1.D1 4.7,9.8 4.7,11
  Top 0.125: 4.7,11 4.6,11.1 4.1,11.1 3.6,11.6 2.9,11.6 2.6,11.9 v2.6,13.2 | U5.G7 7.3,14.1 6.5,14.9 v6,14.9
  Bottom 0.125: v2.6,13.2 4.3,14.9 v6,14.9
N$33
  Top 0.125: U1.E2 4.9,9 4.4,8.5 4.1,8.5 3.5,7.9 3.5,7.5 L1.2
N$34  (via drill 0.12, 0.25)
  Top 0.125: U5.D6 v9.5,14.3 | U1.C1 v4.1,10.4
  Bottom 0.125: v4.1,10.4 5.1,11.5 5.2,11.6 8.3,11.6 8.9,12.2 8.9,13.7 v9.5,14.3
N$35
  Top 0.075: U5.E7 8.7,13.9 8.7,13.1
  Top 0.125: 8.7,13.1 8.6,13 8,13 7.7,13.3 6.5,13.3 4.8,15 4.8,15.8 4.5,16.1 R7.2 3.62,15.93 Q2.1
SWD_1W  (via drill 0.25)
  Top 0.125: U5.A7 12,14.1 v12.3,14.4 | U4.C3 v3.9,19.4 3.9,21.55 4.88,22.53 4.88,23.02 5.1,23.4 5.08,23.48 J3.9
  Bottom 0.125: v12.3,14.4 10.5,16.2 10.5,17 10.7,17.2 10.7,17.6 10.4,17.9 9.3,17.9 8.1,19.1 4.2,19.1 v3.9,19.4
SWD_CLK
  Top 0.125: U5.G6 7.5,14.5 7,15 7,15.2 6.2,16 6.2,18.3 7,19.1 7,21.67 7.3,21.97 8.64,21.97 8.89,21.72 J3.4
SWD_DIO
  Top 0.075: U5.D5 9.1,15.1 9.1,16.7
  Top 0.125: 9.1,16.7 9.3,16.9 9.3,17.8 9.4,17.9 10.5,17.9 10.7,18.1 10.7,18.92 10.16,19.46 J3.2
SWD_DIP_SEL  (via drill 0.25)
  Top 0.075: U5.F4 8.3,15.5 7.9,15.5
  Top 0.125: U4.A2 v2.7,18 | 7.9,15.5 7.7,15.5 v6.9,16.3
  Bottom 0.125: v6.9,16.3 3.5,16.3 2.7,17.1 v2.7,18
SWD_RST
  Top 0.125: J3.10 5.08,19.68 5.1,19.5 5.1,19.3 5.6,18.8 5.6,14.8 6.7,13.7 U5.G8
SWD_TGT_RX
  Top 0.075: 7.9,14.3 8.3,14.3 U5.F6
  Top 0.125: J3.8 6.5,20.2 6.45,20.05 6.45,19.45 5.9,18.9 5.9,15.8 7.4,14.3 7.9,14.3
SWD_TGT_TX
  Top 0.075: U5.E6 8.7,14.7 7.9,14.7
  Top 0.125: J3.6 7.5,19.24 6.5,18.24 6.5,16.2 7.3,15.4 7.3,15 7.6,14.7 7.9,14.7
SWD_VIO  (via drill 0.25)
  Top 0.125: U5.A5 11.3,14.9 12.3,15.9 12.5,15.9 v12.7,16.1 | U4.C1 4.4,17.6 4.7,17.9 4.7,18.1 4.4,18.4 4.4,21.5 5.4,22.5 9.52,22.5 10.22,23.2 | v12,20.8 12.4,21.2 12.4,22.4 11.94,22.86 10.49,22.86 10.12,23.23 10.22,23.2 | 10.22,23.2 10.16,23.66 J3.1 10.16,24.86
  Bottom 0.125: v12.7,16.1 12.7,17.1 12.1,17.7 12.1,19.7 12,19.8 v12,20.8
VDD  (via drill 0.25)
  Top 0.125: U5.E1 C3.1 | U1.A5 6.6,11.3 7.2,11.3 C1.1
  Top 0.305: C3.1 v8.3,17.5 | v6.4,12.6 7.3,11.7 C1.1
  Bottom 0.305: v8.3,17.5 8.3,16.3 6.9,14.9 6.9,13.7 6.4,13.2 v6.4,12.6
VDDIOH  (via drill 0.25)
  Top 0.125: C10.1 U5.C1 | U1.C5 7.6,10 7.7,10.1 7.7,11.8 5.3,14.2 3,14.2 2.8,14.4 2.8,14.97 Q2.2 3.17,15.93 R7.1 3,16.5 v3.5,17 | U4.B1 v3.5,17 | R2.1 4.2,17 v3.5,17
  Top 0.305: C10.1 v10.3,17.5
  Bottom 0.125: v10.3,17.5 9,17.5 8.6,17.9 8.2,17.9 7,16.7 3.8,16.7 v3.5,17

### Text on the board
tPlace: DAP
bPlace: AIN0 | DBG | P0_0 | AIN2 | P0_1 | P1_6 | P0_2 | P1_7 | P0_3 | P4_4 | P0_4 | P4_5 | P0_5 | P4_6 | P0_6 | MAX32625PICO | P4_7 | P0_7 | MAXDAP | 5V | 3.3V | GND | 1.8V
FabDoc1: MAX32625PICO Revision A1 | Total thicknes 1.0mm +/- 0.2mm / (excludes silkscreen and soldermask) | Dielectric - Standard FR-4, / Finish - ENIG / Soldermask - Black / Silkscreen - White / Trace Impedance - / 0.125mm trace ~ 60 Ohm +/- 20% | Stackup / 1 TOP 1oz finished weight / 2 GND 1oz / 15 PWR 1oz / 16 BOT 1oz finished weight